# Altium schematic sheet NODE_DEV_V2.SchDoc: DWM1001 Dev board
size A3; DocumentNumber: 1; Revision: v1; SheetNumber: 1; SheetTotal: 1; SheetFunction: Carrier board for DWM1002
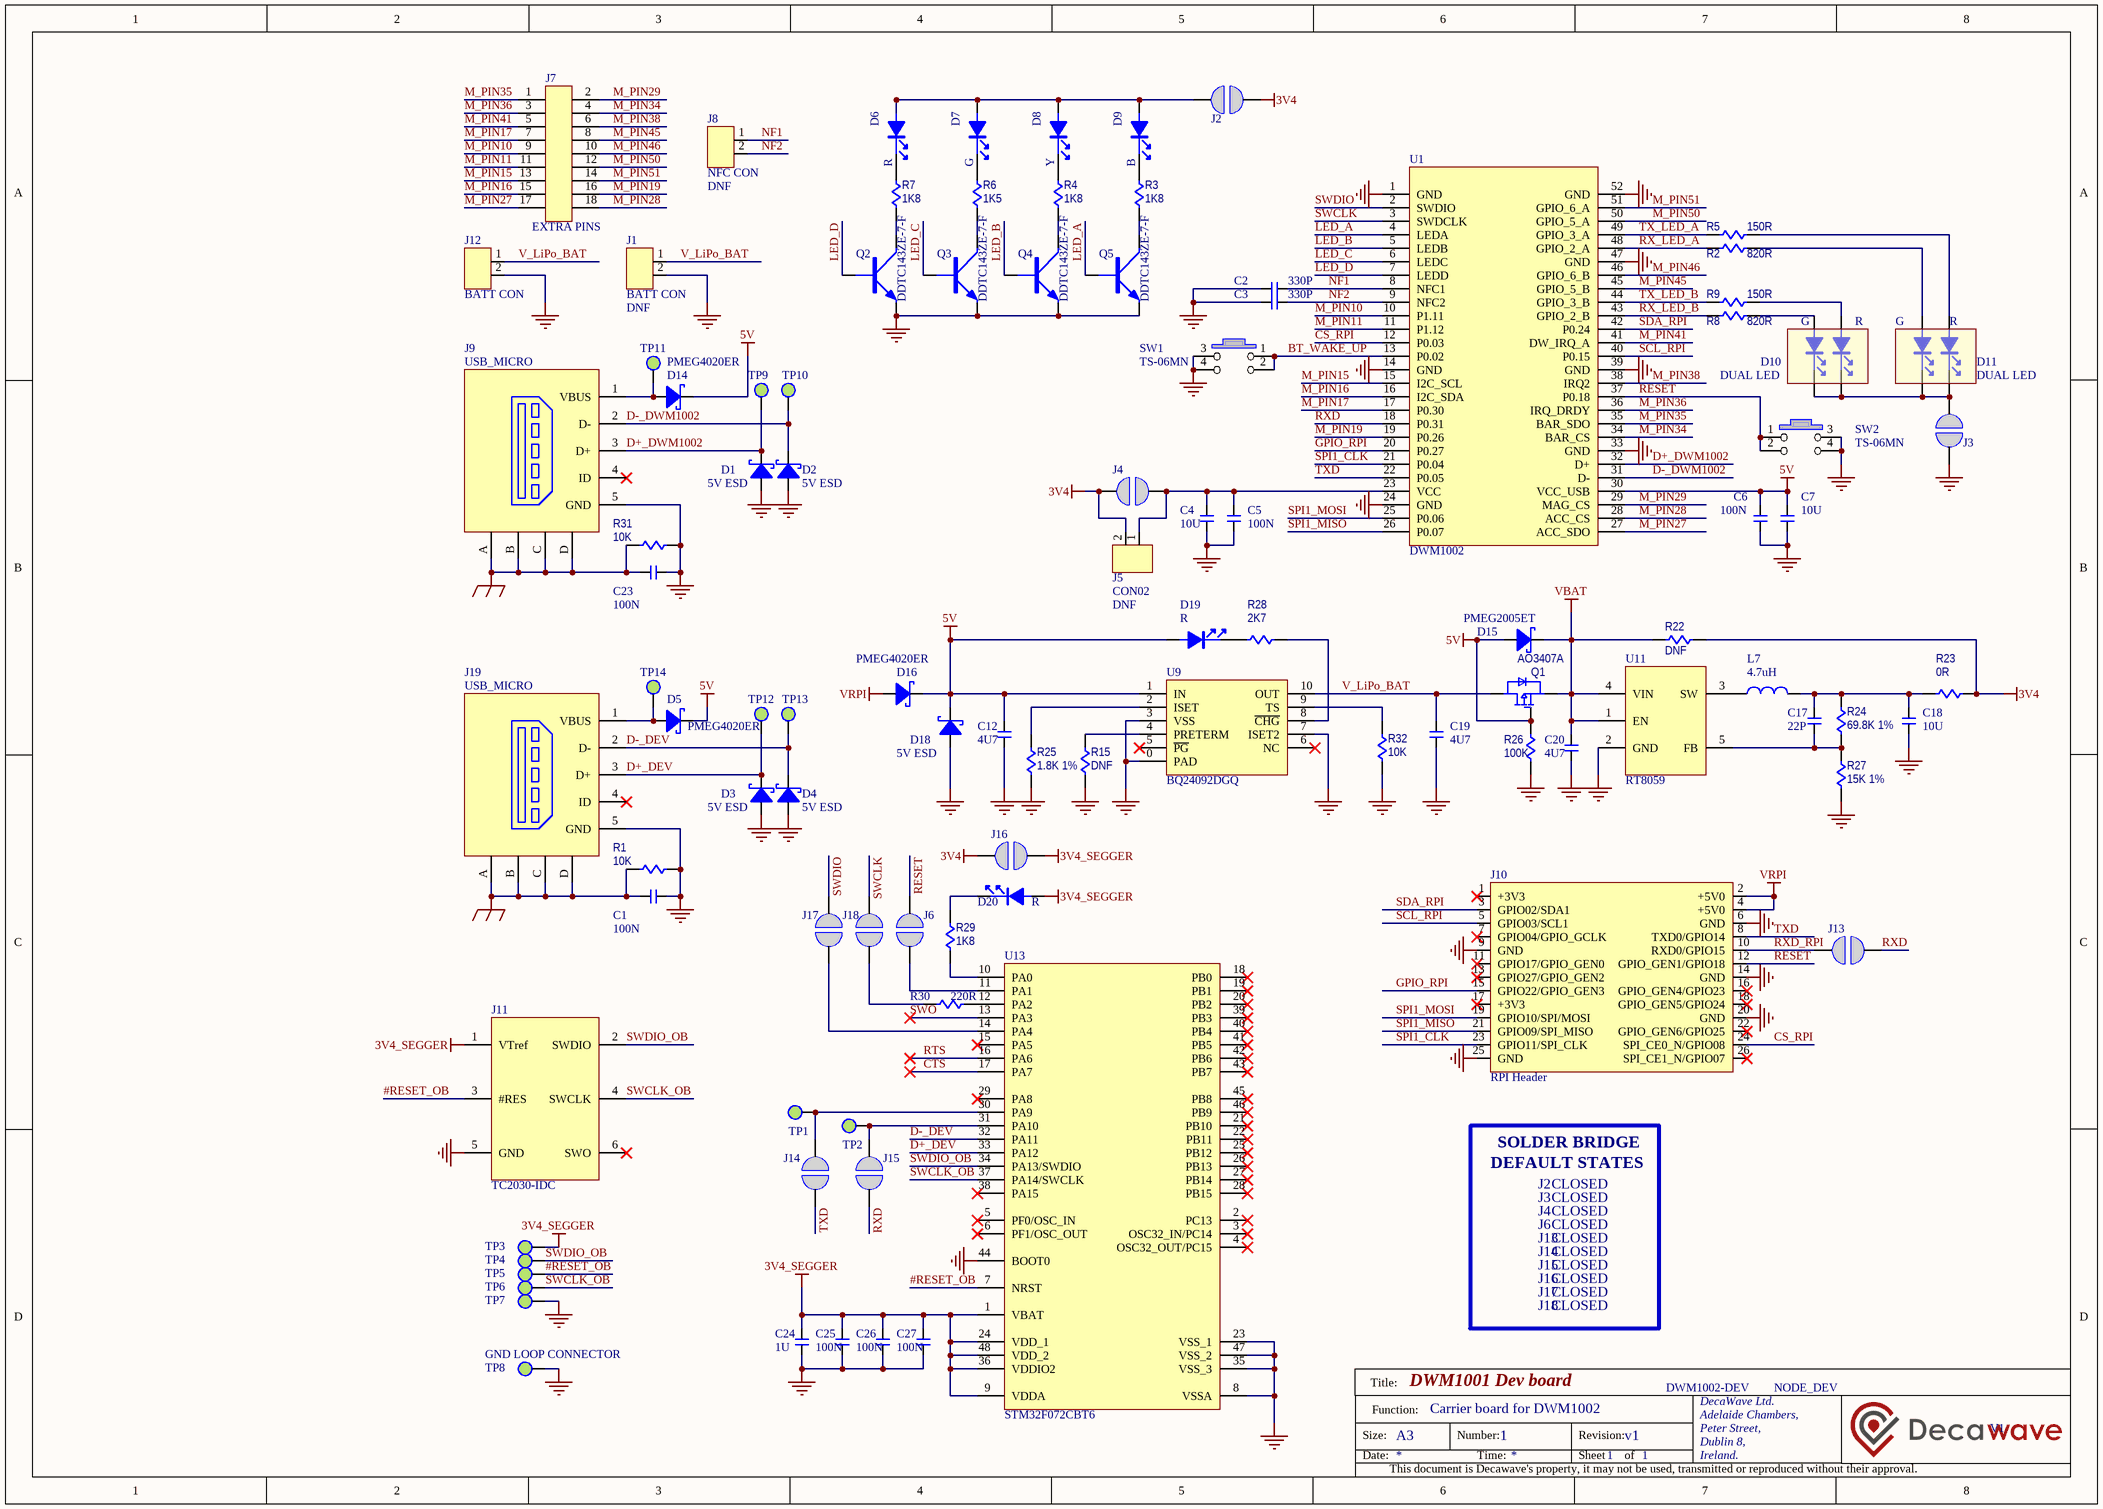
[diagram p0: NODE_DEV_V2.SchDoc]

## Parts
C1  100N  [C-SMT-0402]
C2  330P  [C-SMT-0402]
C3  330P  [C-SMT-0402]
C4  10U  [C-SMT-0603]
C5  100N  [C-SMT-0402]
C6  100N  [C-SMT-0402]
C7  10U  [C-SMT-0603]
C12  4U7  [C-SMT-0603]
C17  22P  [C-SMT-0402]
C18  10U  [C-SMT-0603]
C19  4U7  [C-SMT-0603]
C20  4U7  [C-SMT-0603]
C23  100N  [C-SMT-0402]
C24  1U  [C-SMT-0402]
C25  100N  [C-SMT-0402]
C26  100N  [C-SMT-0402]
C27  100N  [C-SMT-0402]
D1  5V ESD  [C-SMT-0603]
D2  5V ESD  [C-SMT-0603]
D3  5V ESD  [C-SMT-0603]
D4  5V ESD  [C-SMT-0603]
D5  PMEG4020ER  [DIO_SOD123]
D6  R  [LED-SMT-0603]
D7  G  [LED-SMT-0603]
D8  Y  [LED-SMT-0603]
D9  B  [LED-SMT-0603]
D10  DUAL LED  [LED_DUAL]
D11  DUAL LED  [LED_DUAL]
D14  PMEG4020ER  [DIO_SOD123]
D15  PMEG2005ET  [DIO_SOT23]
D16  PMEG4020ER  [DIO_SOD123]
D18  5V ESD  [C-SMT-0603]
D19  R  [LED-SMT-0603]
D20  R  [LED-SMT-0603]
J1  BATT CON  [CON-100MIL-02]
J2  SHORT  [PAD_JUMPER]  (value not drawn)
J3  SHORT  [PAD_JUMPER]  (value not drawn)
J4  SHORT  [PAD_JUMPER]  (value not drawn)
J5  CON02  [CON-100MIL-02]
J6  SHORT  [PAD_JUMPER]  (value not drawn)
J7  EXTRA PINS  [CON-100MIL-2X09]
J8  NFC CON  [CON-100MIL-02]
J9  USB_MICRO  [USB_MICRO_U6F05E-CXT2-B15]
J10  RPI Header  [CON-100MIL-2X13]
J11  TC2030-IDC  [JLINK_6PIN_ADAPTOR]
J12  BATT CON  [SH02AYS]
J13  SHORT  [PAD_JUMPER]  (value not drawn)
J14  SHORT  [PAD_JUMPER]  (value not drawn)
J15  SHORT  [PAD_JUMPER]  (value not drawn)
J16  SHORT  [PAD_JUMPER]  (value not drawn)
J17  SHORT  [PAD_JUMPER]  (value not drawn)
J18  SHORT  [PAD_JUMPER]  (value not drawn)
J19  USB_MICRO  [USB_MICRO_U6F05E-CXT2-B15]
L7  4.7uH  [IND_SDB3015]
Q1  AO3407A  [FET_SOT23_GSD]
Q2  DDTC143ZE-7-F  [SOT-523]
Q3  DDTC143ZE-7-F  [SOT-523]
Q4  DDTC143ZE-7-F  [SOT-523]
Q5  DDTC143ZE-7-F  [SOT-523]
R1  10K  [R-SMT-0402]
R2  820R  [R-SMT-0402]
R3  1K8  [R-SMT-0402]
R4  1K8  [R-SMT-0402]
R5  150R  [R-SMT-0402]
R6  1K5  [R-SMT-0402]
R7  1K8  [R-SMT-0402]
R8  820R  [R-SMT-0402]
R9  150R  [R-SMT-0402]
R15  DNF  [R-SMT-0402]
R22  DNF  [R-SMT-0402]
R23  0R  [R-SMT-0402]
R24  69.8K 1%  [R-SMT-0402]
R25  1.8K 1%  [R-SMT-0402]
R26  100K  [R-SMT-0402]
R27  15K 1%  [R-SMT-0402]
R28  2K7  [R-SMT-0402]
R29  1K8  [R-SMT-0402]
R30  220R  [R-SMT-0402]
R31  10K  [R-SMT-0402]
R32  10K  [R-SMT-0402]
SW1  TS-06MN  [TS-1143S]
SW2  TS-06MN  [TS-1143S]
TP1  TXD  [PAD/R40MIL-SMD]  (value not drawn)
TP2  RXD  [PAD/R40MIL-SMD]  (value not drawn)
TP3  3V4_SEGGER  [PAD/R40MIL-SMD]  (value not drawn)
TP4  SWDIO_OB  [PAD/R40MIL-SMD]  (value not drawn)
TP5  #RESET_OB  [PAD/R40MIL-SMD]  (value not drawn)
TP6  SWCLK_OB  [PAD/R40MIL-SMD]  (value not drawn)
TP7  GND  [PAD/R40MIL-SMD]  (value not drawn)
TP8  GND LOOP CONNECTOR  [TP_LOOP_CONNECTOR]
TP9  D+_DWM1002  [PAD/R40MIL-SMD]  (value not drawn)
TP10  D-_DWM1002  [PAD/R40MIL-SMD]  (value not drawn)
TP11  MODULE_5V  [PAD/R40MIL-SMD]  (value not drawn)
TP12  D+_DEV  [PAD/R40MIL-SMD]  (value not drawn)
TP13  D-_DEV  [PAD/R40MIL-SMD]  (value not drawn)
TP14  DEV_5V  [PAD/R40MIL-SMD]  (value not drawn)
U1  DWM1002  [DWM1002]
U9  BQ24092DGQ  [IC_MSOP10 - TI - DGQ]
U11  RT8059  [SOT23-5]
U13  STM32F072CBT6  [IC_LQFP48]

## Nets
3V4: J2.1 J4.1 J5.2 J16.1 R22.2 R23.2
3V4_SEGGER: C24.1 C25.1 C26.1 C27.1 D20.A J11.1(VTref) J16.2 TP3.1 U13.1(VBAT) U13.9(VDDA) U13.24(VDD_1) U13.36(VDDIO2) U13.48(VDD_2)
5V: C6.1 C7.1 C12.1 D5.2(K) D14.2(K) D15.1(A) D16.2(K) D18.2(K) D19.A Q1.G R26.2 U1.30(VCC_USB) U9.1(IN)
EARTH: C1.1 C23.1 J9.A J9.B J9.C J9.D J19.A J19.B J19.C J19.D R1.1 R31.1
GND: C1.2 C2.1 C3.1 C4.2 C5.2 C6.2 C7.2 C12.2 C18.2 C19.2 C20.2 C23.2 C24.2 C25.2 C26.2 C27.2 D1.1(A) D2.1(A) D3.1(A) D4.1(A) D18.1(A) J1.2 J3.1 J9.5(GND) J10.6(GND) J10.9(GND) J10.14(GND) J10.20(GND) J10.25(GND) J11.5(GND) J12.2 J19.5(GND) Q2.2(E) Q3.2(E) Q4.2(E) Q5.2(E) R1.2 R15.1 R25.1 R26.1 R27.1 R31.2 R32.1 SW1.3 SW1.4 SW2.3 SW2.4 TP7.1 TP8.1 U1.1(GND) U1.14(GND) U1.24(GND) U1.33(GND) U1.39(GND) U1.47(GND) U1.52(GND) U9.0(PAD) U9.3(VSS) U9.7(ISET2) U11.2(GND) U13.8(VSSA) U13.23(VSS_1) U13.35(VSS_3) U13.44(BOOT0) U13.47(VSS_2)
VBAT: C20.1 D15.2(K) Q1.S R22.1 U11.1(EN) U11.4(VIN)
VRPI: D16.1(A) J10.2(+5V0) J10.4(+5V0)
#RESET_OB: J11.3(#RES) TP5.1 U13.7(NRST)
BT_WAKE_UP: SW1.1 SW1.2 U1.13(P0.02)
CS_RPI: J10.24(SPI_CE0_N/GPIO08) U1.12(P0.03)
CTS: U13.17(PA7)
D+_DEV: D3.2(K) J19.3(D+) TP12.1 U13.33(PA12)
D+_DWM1002: D1.2(K) J9.3(D+) TP9.1 U1.32(D+)
D-_DEV: D4.2(K) J19.2(D-) TP13.1 U13.32(PA11)
D-_DWM1002: D2.2(K) J9.2(D-) TP10.1 U1.31(D-)
GPIO_RPI: J10.15(GPIO22/GPIO_GEN3) U1.20(P0.27)
LED_A: Q5.1(B) U1.4(LEDA)
LED_B: Q4.1(B) U1.5(LEDB)
LED_C: Q3.1(B) U1.6(LEDC)
LED_D: Q2.1(B) U1.7(LEDD)
M_PIN10: J7.9 U1.10(P1.11)
M_PIN11: J7.11 U1.11(P1.12)
M_PIN15: J7.13 U1.15(I2C_SCL)
M_PIN16: J7.15 U1.16(I2C_SDA)
M_PIN17: J7.7 U1.17(P0.30)
M_PIN19: J7.16 U1.19(P0.26)
M_PIN27: J7.17 U1.27(ACC_SDO)
M_PIN28: J7.18 U1.28(ACC_CS)
M_PIN29: J7.2 U1.29(MAG_CS)
M_PIN34: J7.4 U1.34(BAR_CS)
M_PIN35: J7.1 U1.35(BAR_SDO)
M_PIN36: J7.3 U1.36(IRQ_DRDY)
M_PIN38: J7.6 U1.38(IRQ2)
M_PIN41: J7.5 U1.41(DW_IRQ_A)
M_PIN45: J7.8 U1.45(GPIO_5_B)
M_PIN46: J7.10 U1.46(GPIO_6_B)
M_PIN50: J7.12 U1.50(GPIO_5_A)
M_PIN51: J7.14 U1.51(GPIO_6_A)
NF1: C2.2 J8.1 U1.8(NFC1)
NF2: C3.2 J8.2 U1.9(NFC2)
RESET: J6.1 J10.12(GPIO_GEN1/GPIO18) SW2.1 SW2.2 U1.37(P0.18)
RTS: U13.16(PA6)
RX_LED_A: R2.1 U1.48(GPIO_2_A)
RX_LED_B: R8.1 U1.43(GPIO_2_B)
RXD: J13.1 J15.1 U1.18(P0.31)
RXD_RPI: J10.10(RXD0/GPIO15) J13.2
SCL_RPI: J10.5(GPIO03/SCL1) U1.40(P0.15)
SDA_RPI: J10.3(GPIO02/SDA1) U1.42(P0.24)
SPI1_CLK: J10.23(GPIO11/SPI_CLK) U1.21(P0.04)
SPI1_MISO: J10.21(GPIO09/SPI_MISO) U1.26(P0.07)
SPI1_MOSI: J10.19(GPIO10/SPI/MOSI) U1.25(P0.06)
SWCLK: J18.1 U1.3(SWDCLK)
SWCLK_OB: J11.4(SWCLK) TP6.1 U13.37(PA14/SWCLK)
SWDIO: J17.1 U1.2(SWDIO)
SWDIO_OB: J11.2(SWDIO) TP4.1 U13.34(PA13/SWDIO)
SWO: U13.13(PA3)
TX_LED_A: R5.1 U1.49(GPIO_3_A)
TX_LED_B: R9.1 U1.44(GPIO_3_B)
TXD: J10.8(TXD0/GPIO14) J14.1 U1.22(P0.05)
V_LiPo_BAT: C19.1 J1.1 J12.1 Q1.D U9.10(OUT)
NetC4_1: C4.1 C5.1 J4.2 J5.1 U1.23(VCC)
NetC17_1: C17.1 C18.1 L7.2 R23.1 R24.2
NetC17_2: C17.2 R24.1 R27.2 U11.5(FB)
NetD5_1: D5.1(A) J19.1(VBUS) TP14.1
NetD6_A: D6.A D7.A D8.A D9.A J2.2
NetD6_K: D6.K R7.1
NetD7_K: D7.K R6.1
NetD8_K: D8.K R4.1
NetD9_K: D9.K R3.1
NetD10_1: D10.1(A1) R9.2
NetD10_2: D10.2(K1) D10.4(K2) D11.2(K1) D11.4(K2) J3.2
NetD10_3: D10.3(A2) R8.2
NetD11_1: D11.1(A1) R5.2
NetD11_3: D11.3(A2) R2.2
NetD14_1: D14.1(A) J9.1(VBUS) TP11.1
NetD19_K: D19.K R28.1
NetD20_K: D20.K R29.2
NetJ6_2: J6.2 U13.11(PA1)
NetJ14_2: J14.2 TP1.1 U13.30(PA9)
NetJ15_2: J15.2 TP2.1 U13.31(PA10)
NetJ17_2: J17.2 U13.14(PA4)
NetJ18_2: J18.2 R30.1
NetL7_1: L7.1 U11.3(SW)
NetQ2_3: Q2.3(C) R7.2
NetQ3_3: Q3.3(C) R6.2
NetQ4_3: Q4.3(C) R4.2
NetQ5_3: Q5.3(C) R3.2
NetR15_2: R15.2 U9.4(PRETERM)
NetR25_2: R25.2 U9.2(ISET)
NetR28_2: R28.2 U9.8(~{CHG})
NetR29_1: R29.1 U13.10(PA0)
NetR30_2: R30.2 U13.12(PA2)
NetR32_2: R32.2 U9.9(TS)

Not connected (* = marked no-connect by the designer): J9 4(ID)*; J10 1(+3V3)* 7(GPIO04/GPIO_GCLK)* 11(GPIO17/GPIO_GEN0)* 13(GPIO27/GPIO_GEN2)* 16(GPIO_GEN4/GPIO23)* 17(+3V3)* 18(GPIO_GEN5/GPIO24)* 22(GPIO_GEN6/GPIO25)* 26(SPI_CE1_N/GPIO07)*; J11 6(SWO)*; J19 4(ID)*; U9 5(~{PG})* 6(NC)*; U13 2(PC13)* 3(OSC32_IN/PC14)* 4(OSC32_OUT/PC15)* 5(PF0/OSC_IN)* 6(PF1/OSC_OUT)* 15(PA5)* 18(PB0)* 19(PB1)* 20(PB2)* 21(PB10)* 22(PB11)* 25(PB12)* 26(PB13)* 27(PB14)* 28(PB15)* 29(PA8)* 38(PA15)* 39(PB3)* 40(PB4)* 41(PB5)* 42(PB6)* 43(PB7)* 45(PB8)* 46(PB9)*

## Notes on the sheet
- (near D10) G
- (near D10) R
- (near D11) G
- (near D11) R
- DEFAULT STATES
- SOLDER BRIDGE
- J2
- CLOSED
- J3
- J13
- J14
- J4
- J6
- J15
- J16
- J17
- J18
- DWM1002-DEV
- NODE_DEV
- V1
- Title:
- Size:
- Date:
- Function:
- A3
- Number:
- Time:
- Revision:
- Sheet
- of
- DecaWave Ltd.
- Adelaide Chambers,
- Peter Street,
- Dublin 8,
- Ireland.
- This document is Decawave's property, it may not be used, transmitted or reproduced without their approval.
- (in symbol CON02) DNF

## Library data of the parts
C1-C7 C12 C17-C20 C23-C27 = C-SMT-0402: *C-SMT-0402; Size: (0402)
D1-D5 D14-D16 D18 = DIODE_SCHOTTKY: Diode
D6-D9 D19 D20 = LED
D10 D11 = LED_X2
J1 J5 J8 J12 = CON02: 2 pin Connector
J2-J4 J6 J13-J18 = JUMPER_OPEN
J7 = CON(2X09)_1
J9 J19 = CON05_USB_2: USB-MR1-05-TH-MB
J10 = RPI_HEADER_SHORT
J11 = TC2030-IDC: J-Link 6-pin Programming Pads
L7 = L: INDUCTOR
Q1 = MOSFET-P1: P-MOSFET
Q2-Q5 = TR_NPN: TRANSISTOR NPN
R1-R9 R15 R22-R32 = R-SMT-0402: *R-SMT-0402; Value: 500R; VC Part No.: *
SW1 SW2 = TACT_SW/4PIN
TP1-TP14 = TEST POINT_1: TEST POINT
U13 = STM32F072CxU6: J-LINK MCU